# EAGLE schematic Teensy-Sensors-Setup (EAGLE 8.4.3)
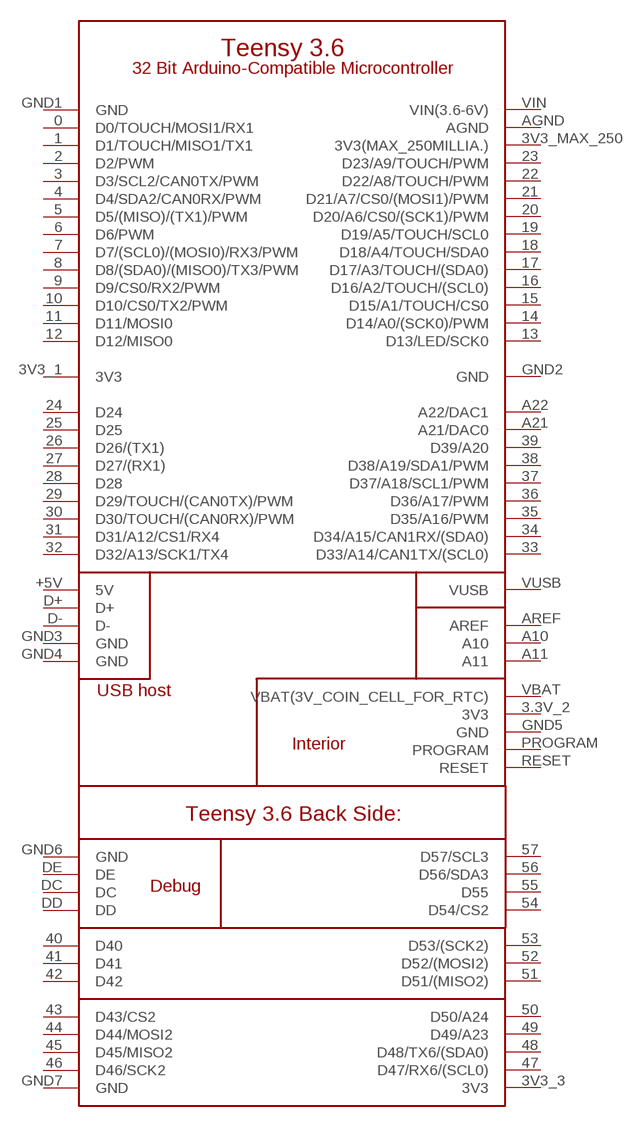
[diagram p0: schematic, sheet 1]

## Parts
U$1  TEENSY-3.6_FULL  [TEENSY-3.6_FULL]
Unconnected: U$1.0(D0/TOUCH/MOSI1/RX1) U$1.1(D1/TOUCH/MISO1/TX1) U$1.2(D2/PWM) U$1.3(D3/SCL2/CAN0TX/PWM) U$1.3.3V_2(3V3) U$1.3V3_3(3V3) U$1.3V3_MAX_250(3V3(MAX_250MILLIA.)) U$1.4(D4/SDA2/CAN0RX/PWM) U$1.5(D5/(MISO)/(TX1)/PWM) U$1.6(D6/PWM) U$1.7(D7/(SCL0)/(MOSI0)/RX3/PWM) U$1.8(D8/(SDA0)/(MISO0)/TX3/PWM) U$1.9(D9/CS0/RX2/PWM) U$1.10(D10/CS0/TX2/PWM) U$1.11(D11/MOSI0) U$1.12(D12/MISO0) U$1.13(D13/LED/SCK0) U$1.14(D14/A0/(SCK0)/PWM) U$1.15(D15/A1/TOUCH/CS0) U$1.16(D16/A2/TOUCH/(SCL0)) U$1.17(D17/A3/TOUCH/(SDA0)) U$1.18(D18/A4/TOUCH/SDA0) U$1.19(D19/A5/TOUCH/SCL0) U$1.20(D20/A6/CS0/(SCK1)/PWM) U$1.21(D21/A7/CS0/(MOSI1)/PWM) U$1.22(D22/A8/TOUCH/PWM) U$1.23(D23/A9/TOUCH/PWM) U$1.24(D24) U$1.25(D25) U$1.26(D26/(TX1)) U$1.27(D27/(RX1)) U$1.28(D28) U$1.29(D29/TOUCH/(CAN0TX)/PWM) U$1.30(D30/TOUCH/(CAN0RX)/PWM) U$1.31(D31/A12/CS1/RX4) U$1.32(D32/A13/SCK1/TX4) U$1.33(D33/A14/CAN1TX/(SCL0)) U$1.34(D34/A15/CAN1RX/(SDA0)) U$1.35(D35/A16/PWM) U$1.36(D36/A17/PWM) U$1.37(D37/A18/SCL1/PWM) U$1.38(D38/A19/SDA1/PWM) U$1.39(D39/A20) U$1.40(D40) U$1.41(D41) U$1.42(D42) U$1.43(D43/CS2) U$1.44(D44/MOSI2) U$1.45(D45/MISO2) U$1.46(D46/SCK2) U$1.47(D47/RX6/(SCL0)) U$1.48(D48/TX6/(SDA0)) U$1.49(D49/A23) U$1.50(D50/A24) U$1.51(D51/(MISO2)) U$1.52(D52/(MOSI2)) U$1.53(D53/(SCK2)) U$1.54(D54/CS2) U$1.55(D55) U$1.56(D56/SDA3) U$1.57(D57/SCL3) U$1.+5V(5V) U$1.A10 U$1.A11 U$1.A21(A21/DAC0) U$1.A22(A22/DAC1) U$1.AREF U$1.D+ U$1.D- U$1.DC U$1.DD U$1.DE U$1.GND3(GND) U$1.GND4(GND) U$1.GND5(GND) U$1.GND6(GND) U$1.GND7(GND) U$1.PROGRAM U$1.RESET U$1.VBAT(VBAT(3V_COIN_CELL_FOR_RTC)) U$1.VUSB

## Power pins joined to a net without a drawn wire
3V3: U$1.3V3_1(3V3)
AGND: U$1.AGND
GND: U$1.GND1(GND) U$1.GND2(GND)
VIN(3.6-6V): U$1.VIN(VIN(3.6-6V))

## Library data of the parts
U$1 = Teensy-3.6:TEENSY-3.6_FULL